# Altium schematic sheet HDMI.SchDoc
size A; SheetNumber: 2; SheetTotal: 12
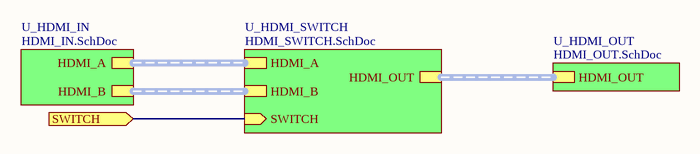
[diagram p0: HDMI.SchDoc]

## Sub-sheets
U_HDMI_IN = HDMI_IN.SchDoc: HDMI_A (harness HDMI_A), HDMI_B (harness HDMI_B)
U_HDMI_OUT = HDMI_OUT.SchDoc: HDMI_OUT (harness HDMI_OUT)
U_HDMI_SWITCH = HDMI_SWITCH.SchDoc: HDMI_A (harness HDMI_A), HDMI_B (harness HDMI_B), HDMI_OUT (harness HDMI_OUT), SWITCH (in)

## Ports
SWITCH (in, see TOP[2B], HDMI_SWITCH[1C])

## Nets
SWITCH: port SWITCH, sheet U_HDMI_SWITCH/SWITCH

## Buses and harness runs
harness sheet U_HDMI_IN/HDMI_A = sheet U_HDMI_SWITCH/HDMI_A
harness sheet U_HDMI_IN/HDMI_B = sheet U_HDMI_SWITCH/HDMI_B
harness sheet U_HDMI_OUT/HDMI_OUT = sheet U_HDMI_SWITCH/HDMI_OUT